# Altium schematic sheet Connectors.SchDoc: Connectors
size A3; Author: A.Horvath; Organization: Reichle & De-Massari; Address1: Binzstrasse 32; Address2: 8620 Wetzikon; Address3: Switzerland; DocumentNumber: 9; Revision: V0.1; SheetNumber: 9; SheetTotal: 11
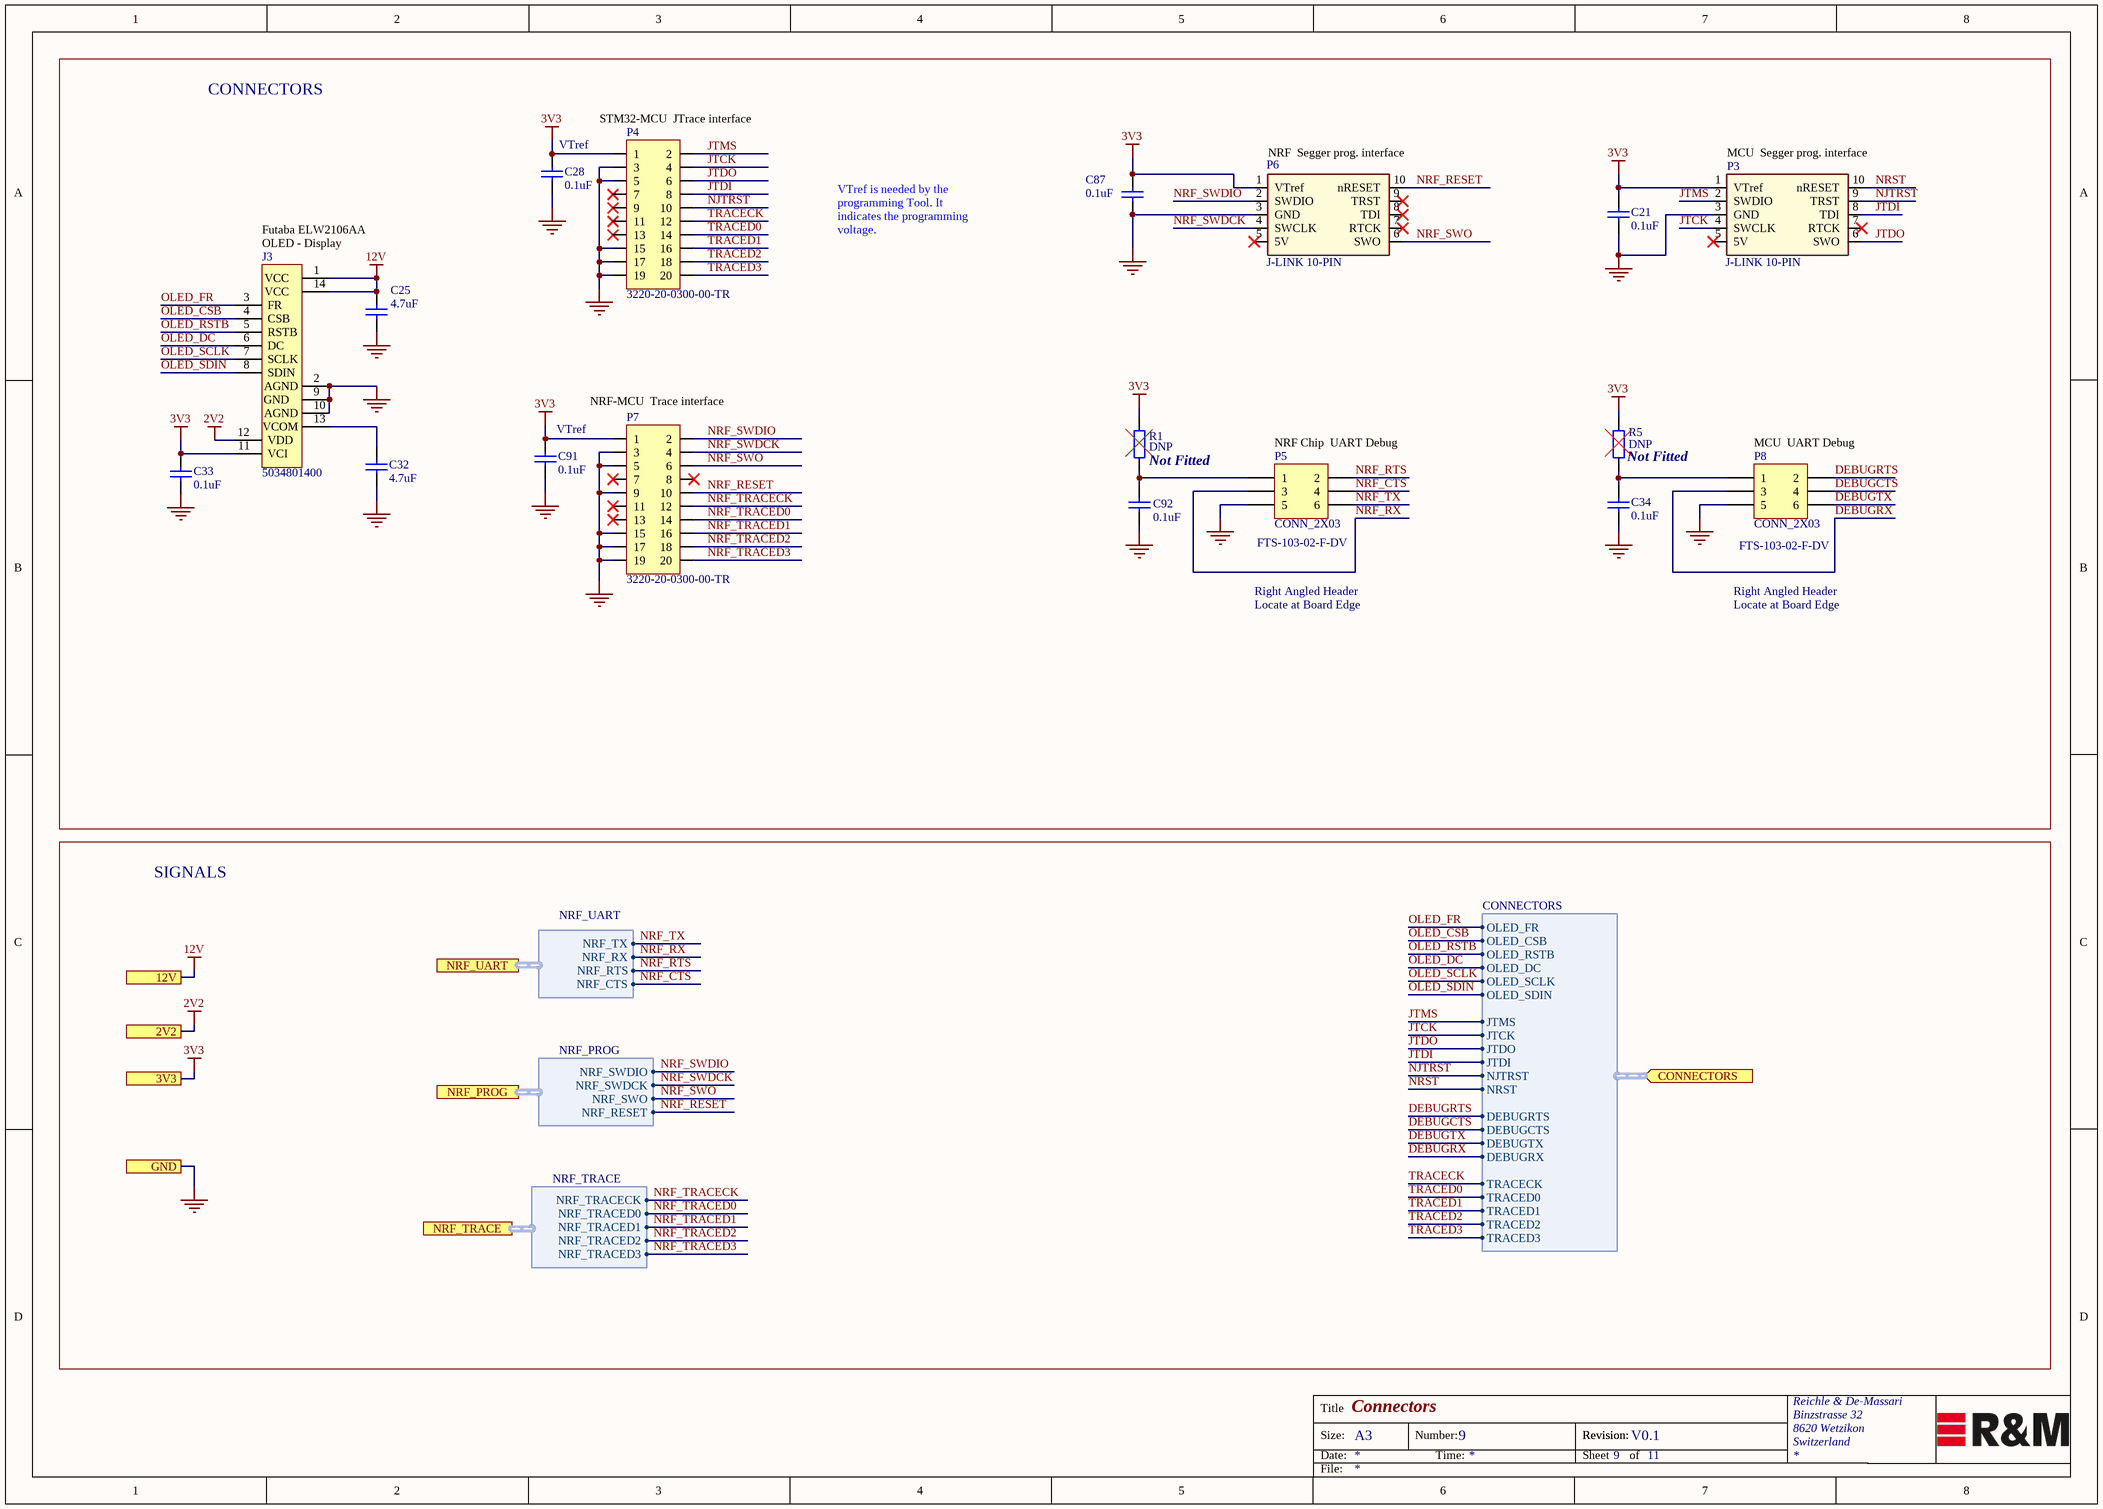
[diagram p0: Connectors.SchDoc]

## Parts
C21  0.1uF  [Ceramic Capacitor 0402 EIA]
C25  4.7uF  [Ceramic Capacitor 0603 EIA]
C28  0.1uF  [Ceramic Capacitor 0402 EIA]
C32  4.7uF  [Ceramic Capacitor 0603 EIA]
C33  0.1uF  [Ceramic Capacitor 0402 EIA]
C34  0.1uF  [Ceramic Capacitor 0402 EIA]
C87  0.1uF  [Ceramic Capacitor 0402 EIA]
C91  0.1uF  [Ceramic Capacitor 0402 EIA]
C92  0.1uF  [Ceramic Capacitor 0402 EIA]
J3  5034801400  [Molex_5034801400]
P3  J-LINK 10-PIN  [CONN-SEGGER-10-PIN]
P4  3220-20-0300-00-TR  [CNC_Tech_Conn_Header_2x10]
P5  CONN_2X03  Manufacturer PartNr: FTS-103-02-F-DV  [Samtec_FTS-103-02-F-DV_6_R]
P6  J-LINK 10-PIN  [CONN-SEGGER-10-PIN]
P7  3220-20-0300-00-TR  [CNC_Tech_Conn_Header_2x10]
P8  CONN_2X03  Manufacturer PartNr: FTS-103-02-F-DV  [Samtec_FTS-103-02-F-DV_6_R]
R1  DNP  [Resistor 0603 EIA]
R5  DNP  [Resistor 0603 EIA]

## Ports
2V2, 3V3, 12V, CONNECTORS (in, harness CONNECTORS), GND, NRF_PROG (harness NRF_PROG), NRF_TRACE (harness NRF_TRACE), NRF_UART (harness NRF_UART)

## Harnesses
NRF_PROG: NRF_SWDIO, NRF_SWDCK, NRF_RESET, NRF_SWO
CONNECTORS: OLED_FR, OLED_CSB, OLED_RSTB, OLED_DC, OLED_SCLK, OLED_SDIN, JTMS, JTCK, JTDO, JTDI, NJTRST, NRST, DEBUGRTS, DEBUGCTS, DEBUGTX, DEBUGRX, TRACECK, TRACED0, TRACED1, TRACED2, TRACED3
NRF_TRACE: NRF_TRACECK, NRF_TRACED0, NRF_TRACED1, NRF_TRACED2, NRF_TRACED3
NRF_UART: NRF_TX, NRF_RX, NRF_RTS, NRF_CTS

## Nets
2V2: J3.12(VDD) ; port 2V2
3V3: C21.2 C28.2 C33.2 C87.2 C91.2 J3.11(VCI) P3.1(VTref) P4.1 P6.1(VTref) P7.1 R1.1 R5.1 ; port 3V3
12V: C25.2 J3.1(VCC) J3.14(VCC) ; port 12V
GND: C21.1 C25.1 C28.1 C32.1 C33.1 C34.1 C87.1 C91.1 C92.1 J3.2(AGND) J3.9(GND) J3.10(AGND) P3.3(GND) P4.3 P4.5 P4.15 P4.17 P4.19 P5.5 P6.3(GND) P7.3 P7.5 P7.9 P7.15 P7.17 P7.19 P8.5 ; port GND
DEBUGCTS: P8.4 ; port CONNECTORS.DEBUGCTS
DEBUGRTS: P8.2 ; port CONNECTORS.DEBUGRTS
DEBUGRX: P8.3 ; port CONNECTORS.DEBUGRX
DEBUGTX: P8.6 ; port CONNECTORS.DEBUGTX
JTCK: P3.4(SWCLK) P4.4 ; port CONNECTORS.JTCK
JTDI: P3.8(TDI) P4.8 ; port CONNECTORS.JTDI
JTDO: P3.6(SWO) P4.6 ; port CONNECTORS.JTDO
JTMS: P3.2(SWDIO) P4.2 ; port CONNECTORS.JTMS
NJTRST: P3.9(TRST) P4.10 ; port CONNECTORS.NJTRST
NRF_CTS: P5.4 ; port NRF_UART.NRF_CTS
NRF_RESET: P6.10(nRESET) P7.10 ; port NRF_PROG.NRF_RESET
NRF_RTS: P5.2 ; port NRF_UART.NRF_RTS
NRF_RX: P5.3 ; port NRF_UART.NRF_RX
NRF_SWDCK: P6.4(SWCLK) P7.4 ; port NRF_PROG.NRF_SWDCK
NRF_SWDIO: P6.2(SWDIO) P7.2 ; port NRF_PROG.NRF_SWDIO
NRF_SWO: P6.6(SWO) P7.6 ; port NRF_PROG.NRF_SWO
NRF_TRACECK: P7.12 ; port NRF_TRACE.NRF_TRACECK
NRF_TRACED0: P7.14 ; port NRF_TRACE.NRF_TRACED0
NRF_TRACED1: P7.16 ; port NRF_TRACE.NRF_TRACED1
NRF_TRACED2: P7.18 ; port NRF_TRACE.NRF_TRACED2
NRF_TRACED3: P7.20 ; port NRF_TRACE.NRF_TRACED3
NRF_TX: P5.6 ; port NRF_UART.NRF_TX
NRST: P3.10(nRESET) ; port CONNECTORS.NRST
OLED_CSB: J3.4(CSB) ; port CONNECTORS.OLED_CSB
OLED_DC: J3.6(DC) ; port CONNECTORS.OLED_DC
OLED_FR: J3.3(FR) ; port CONNECTORS.OLED_FR
OLED_RSTB: J3.5(RSTB) ; port CONNECTORS.OLED_RSTB
OLED_SCLK: J3.7(SCLK) ; port CONNECTORS.OLED_SCLK
OLED_SDIN: J3.8(SDIN) ; port CONNECTORS.OLED_SDIN
TRACECK: P4.12 ; port CONNECTORS.TRACECK
TRACED0: P4.14 ; port CONNECTORS.TRACED0
TRACED1: P4.16 ; port CONNECTORS.TRACED1
TRACED2: P4.18 ; port CONNECTORS.TRACED2
TRACED3: P4.20 ; port CONNECTORS.TRACED3
NetC32_2: C32.2 J3.13(VCOM)
NetC34_2: C34.2 P8.1 R5.2
NetC92_2: C92.2 P5.1 R1.2

Not connected (* = marked no-connect by the designer): P3 5(5V)* 7(RTCK)*; P4 7* 9* 11* 13*; P6 5(5V)* 7(RTCK)* 8(TDI)* 9(TRST)*; P7 7* 8* 11* 13*

## Notes on the sheet
- CONNECTORS
- (near C28) VTref
- (near P4) STM32-MCU  JTrace interface
- (near P6) NRF  Segger prog. interface
- (near P3) MCU  Segger prog. interface
- (near J3) Futaba ELW2106AA
- (near J3) OLED - Display
- VTref is needed by the programming Tool. It indicates the programming voltage.
- (near C91) VTref
- (near P7) NRF-MCU  Trace interface
- (near P5) NRF Chip  UART Debug
- (near P8) MCU  UART Debug
- (near R1) Not Fitted
- (near R5) Not Fitted
- Locate at Board Edge
- Right Angled Header
- SIGNALS
- Title
- Size:
- Date:
- A3
- Number:
- Time:
- Revision:
- Sheet
- of
- File:

## Library data of the parts
C21 C28 C34 C87 C91 C92 = Cap_0.1uF_0402_10V: 0.1µF ±20% 10V Ceramic Capacitor X5R 0402 (1005 Metric); Manufacturer: Wurth Electronics; Manufacturer PartNr: 885012105010; voltage: 10VDC; Replaceable: yes; value: 0.1uF; tolerance: 20%; Footprint/Package: 0402; Dielectric Grade: X5R; ComponentLink1Description: mouser; ComponentLink1URL: https://www.mouser.ch/ProductDetail/Wurth-Electronics/885012105010?qs=sGAEpiMZZMs0AnBnWHyRQEGbLOF2VP1ihL84oCjXnlO407YOHi%2fQbw%3d%3d; Supplier 3: Mouser; Supplier 2: Farnell; Supplier 1: Digi-Key; Supplier Part Number 1: 732-7487-1-ND; Supplier Part Number 2: 2533928; Supplier Part Number 3: 710-885012105010
C25 C32 = Cap_4.7uF_0603_16V: 4.7µF ±10% 16V Ceramic Capacitor X5R 0603 (1608 Metric); Manufracturer: Murata Electronics; Manufacturer PartNr: GRM188R61C475KAAJD; voltage: 16 VDC; Replaceable: yes; value: 4.7uF; tolerance: 10%; Dielectric Grade: X5R; Footprint/Package: 0603 (1608 metric); Supplier 1: Digi-Key; Supplier Part Number 1: 490-10481-1-ND
C33 = Cap_0.1uF_0402_16V: 0.1µF ±20% 16V Ceramic Capacitor X7R 0402 (1005 Metric); Manufacturer: KEMET; Manufacturer PartNr: C0402C104M4RACAUTO; voltage: 16VDC; Replaceable: yes; value: 0.1uF; tolerance: 20%; Footprint/Package: 0402 (1005 Metric); Dielectric Grade: X7R; ComponentLink1Description: mouser; ComponentLink1URL: https://www.mouser.ch/ProductDetail/KEMET/C0402C104M4RACAUTO?qs=sGAEpiMZZMs0AnBnWHyRQB295tntAovf0Dzw3tVX6zRfKTwHFThmZw%3d%3d; Supplier 1: Digi-Key; Supplier Part Number 1: 399-13707-1-ND
J3 = CONN_Molex_FPC_14pin_0.5mm: 14 Position FFC, FPC Connector Contacts, Top and Bottom, Pitch  0.020" (0.50mm) Surface Mount, Right Angle; Manufacturer: Molex; voltage: 50V; Replaceable: no; Manufacturer PartNr: 5034801400; Footprint/Package: specific, see datasheet; Supplier 1: Digi-Key; Supplier Part Number 1: WM1442CT-ND; value: 5034801400; tolerance: -; Dielectric Grade: -
P3 P6 = CONN_Segger_10_PIN: Segger, J-Link 10-pin Needle Adapter
P4 P7 = CONN_2X10_Header_1.27: Connector Header Surface Mount 20 position 0.050" (1.27mm); Manufacturer: CNC Tech; Replaceable: no; Footprint/Package: 2x10 Pads, see datasheet; Supplier 1: Digi-Key; ComponentLink1Description: mouser; ComponentLink1URL: https://www.mouser.ch/ProductDetail/Harwin/M50-3030342?qs=%2fha2pyFaduiRpn7Sn9fWVp%252bNpdzGcgnS82sSCZLLu%2fUjQZVEB%252bIkNw%3d%3d; Supplier Part Number 1: 1175-2646-1-ND; power: -; Dielectric Grade: -; Manufacturer PartNr: 3220-20-0300-00-TR; value: 3220-20-0300-00-TR; voltage: -
P5 P8 = CONN_2X03_FTS-103-02-F-DV: 6Pin, 2Rows, MICRO LOW-PROFILE TERMINAL STRIPS; Manufacturer: Samtec; Replaceable: *; Footprint/Package: *; Supplier 1: Digi-Key; Supplier 2: Mouser; Supplier 3: Farnell; Supplier Part Number 1: SAM13893DKR-ND; Supplier Part Number 2: 200-FTS10302FDVTR; Supplier Part Number 3: 1928022
R1 R5 = Res_DNP_0603: Resistor: do not populate; Replaceable: no; value: DNP; tolerance: *; power: *; Manufacturer: do not populate; Footprint/Package: 0603; Manufacturer PartNr: do not populate